# EAGLE design BusCon15 (EAGLE 4.11)
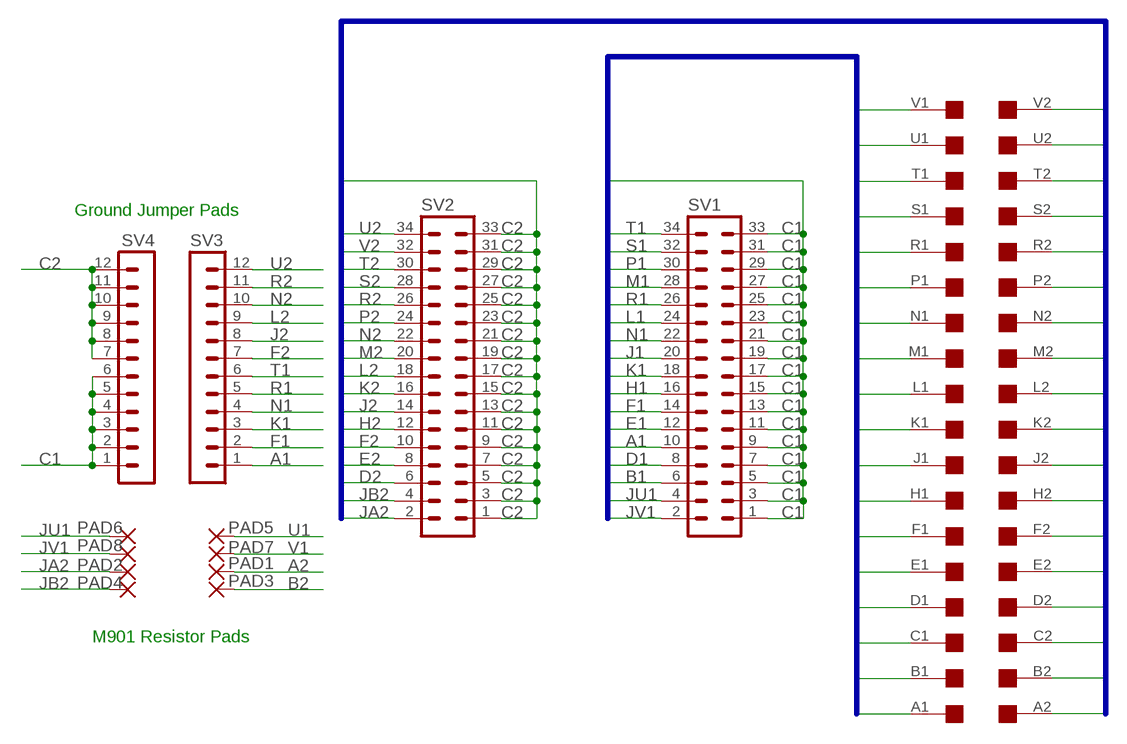
[diagram p0: schematic, sheet 1]

## Parts
PAD1  1,6/0,8  [1,6/0,8]
PAD2  1,6/0,8  [1,6/0,8]
PAD3  1,6/0,8  [1,6/0,8]
PAD4  1,6/0,8  [1,6/0,8]
PAD5  1,6/0,8  [1,6/0,8]
PAD6  1,6/0,8  [1,6/0,8]
PAD7  1,6/0,8  [1,6/0,8]
PAD8  1,6/0,8  [1,6/0,8]
SV1  MA17-2  [MA17-2]
SV2  MA17-2  [MA17-2]
SV3  MA12-1  [MA12-1]
SV4  MA12-1  [MA12-1]
U$4  EDGE-2  [EDGE-CON2]

## Nets
A1: SV1.10 SV3.1 U$4.A1
A2: PAD1.1(P) U$4.A2
B1: SV1.6 U$4.B1
B2: PAD3.1(P) U$4.B2
C1: SV1.1 SV1.3 SV1.5 SV1.7 SV1.9 SV1.11 SV1.13 SV1.15 SV1.17 SV1.19 SV1.21 SV1.23 SV1.25 SV1.27 SV1.29 SV1.31 SV1.33 SV4.1 SV4.2 SV4.3 SV4.4 SV4.5 SV4.6 U$4.C1
C2: SV2.1 SV2.3 SV2.5 SV2.7 SV2.9 SV2.11 SV2.13 SV2.15 SV2.17 SV2.19 SV2.21 SV2.23 SV2.25 SV2.27 SV2.29 SV2.31 SV2.33 SV4.7 SV4.8 SV4.9 SV4.10 SV4.11 SV4.12 U$4.C2
D1: SV1.8 U$4.D1
D2: SV2.6 U$4.D2
E1: SV1.12 U$4.E1
E2: SV2.8 U$4.E2
F1: SV1.14 SV3.2 U$4.F1
F2: SV2.10 SV3.7 U$4.F2
H1: SV1.16 U$4.H1
H2: SV2.12 U$4.H2
J1: SV1.20 U$4.J1
J2: SV2.14 SV3.8 U$4.J2
JA2: PAD2.1(P) SV2.2
JB2: PAD4.1(P) SV2.4
JU1: PAD6.1(P) SV1.4
JV1: PAD8.1(P) SV1.2
K1: SV1.18 SV3.3 U$4.K1
K2: SV2.16 U$4.K2
L1: SV1.24 U$4.L1
L2: SV2.18 SV3.9 U$4.L2
M1: SV1.28 U$4.M1
M2: SV2.20 U$4.M2
N1: SV1.22 SV3.4 U$4.N1
N2: SV2.22 SV3.10 U$4.N2
P1: SV1.30 U$4.P1
P2: SV2.24 U$4.P2
R1: SV1.26 SV3.5 U$4.R1
R2: SV2.26 SV3.11 U$4.R2
S1: SV1.32 U$4.S1
S2: SV2.28 U$4.S2
T1: SV1.34 SV3.6 U$4.T1
T2: SV2.30 U$4.T2
U1: PAD5.1(P) U$4.U1
U2: SV2.34 SV3.12 U$4.U2
V1: PAD7.1(P) U$4.V1
V2: SV2.32 U$4.V2

## Buses
A1,B1,C1,D1,E1,F1,H1,J1,K1,L1,M1,N1,P1,R1,S1,T1,U1,V1
A2,B2,C2,D2,E2,F2,H2,J2,K2,L2,M2,N2,P2,R2,S2,T2,U2,V2

## Notes on the sheet
- Ground Jumper Pads
- M901 Resistor Pads

## Library data of the parts
PAD1-PAD8 = wirepad:1,6/0,8: THROUGH-HOLE PAD
SV1 SV2 = con-lstb:MA17-2: PIN HEADER
SV3 SV4 = con-lstb:MA12-1: PIN HEADER
U$4 = dec-con:EDGE-2: Double-Sided DEC edge connector.

## Board
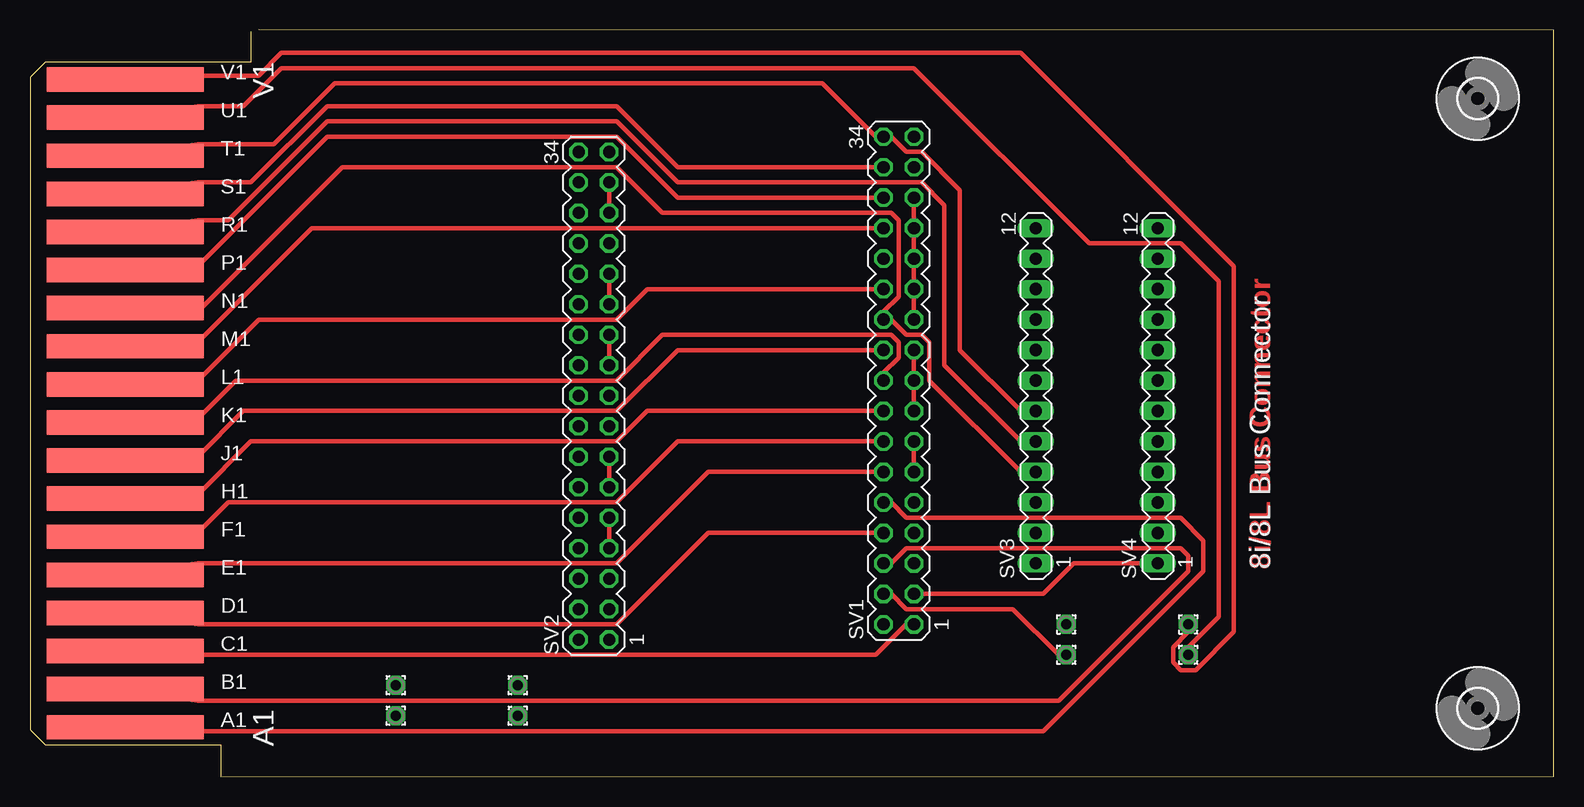
[diagram p1: board, top side]
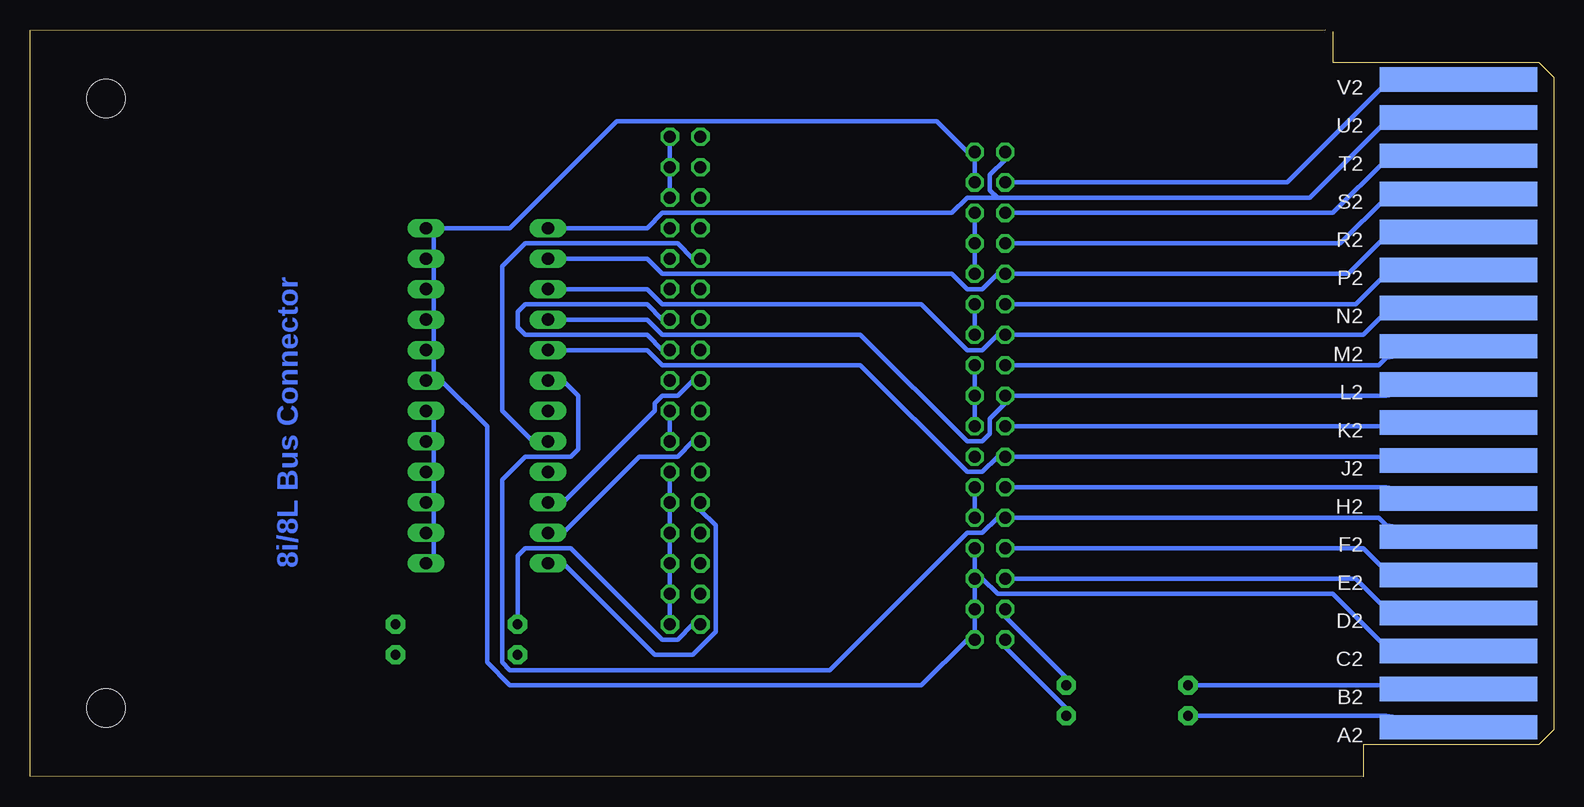
[diagram p2: board, bottom side, seen from below]

Size 126.98 x 62.23 mm. Coordinates in mm from the lower left corner, seen from the top.
Outline: 15.88,0 126.98,0.04 126.98,62.19 19.05,62.23
Copper layers (1*16): Top 0.035mm / dielectric 1.5mm / Bottom 0.035mm
Design rules "olimex10mil": minimum track width 15mil, minimum drill 24mil, track to track 15mil, track to pad 10mil, pad to pad 10mil, via to via 10mil, smd to smd 10mil, copper to edge 25mil, drill to drill 10mil, minimum pad ring 10mil, minimum via ring 8mil, stop-mask expansion 0mil, vias tented up to drill 0mil, thermal gap 10mil

### Footprints (pad centres in the part's own frame; a part is rotated, then mirrored left to right if it is on the bottom)
1,6/0,8 = drill 0.813 pad 1.6 octagon: 1 0,0
MA17-2 = drill 1.016 octagon: 1 -20.32,-1.27; 2 -20.32,1.27; 3 -17.78,-1.27; 4 -17.78,1.27; 5 -15.24,-1.27; 6 -15.24,1.27; 7 -12.7,-1.27; 8 -12.7,1.27; 9 -10.16,-1.27; 10 -10.16,1.27; 11 -7.62,-1.27; 12 -7.62,1.27; 13 -5.08,-1.27; 14 -5.08,1.27; 15 -2.54,-1.27; 16 -2.54,1.27; 17 0,-1.27; 18 0,1.27; 19 2.54,-1.27; 20 2.54,1.27; 21 5.08,-1.27; 22 5.08,1.27; 23 7.62,-1.27; 24 7.62,1.27; 25 10.16,-1.27; 26 10.16,1.27; 27 12.7,-1.27; 28 12.7,1.27; 29 15.24,-1.27; 30 15.24,1.27; 31 17.78,-1.27; 32 17.78,1.27; 33 20.32,-1.27; 34 20.32,1.27
MA12-1 = drill 1.016 long: 1 -13.97,0; 2 -11.43,0; 3 -8.89,0; 4 -6.35,0; 5 -3.81,0; 6 -1.27,0; 7 1.27,0; 8 3.81,0; 9 6.35,0; 10 8.89,0; 11 11.43,0; 12 13.97,0
3,2 = hole 3.2: 0,0
EDGE-CON2 = smd 13.106 x 2.032: A1 7.938,4.128; B1 7.938,7.303; C1 7.938,10.477; D1 7.938,13.652; E1 7.938,16.828; F1 7.938,20.003; H1 7.938,23.177; J1 7.938,26.352; K1 7.938,29.527; L1 7.938,32.703; M1 7.938,35.877; N1 7.938,39.053; P1 7.938,42.227; R1 7.938,45.403; S1 7.938,48.578; T1 7.938,51.752; U1 7.938,54.928; V1 7.938,58.102 | smd 13.106 x 2.032 bottom: A2 7.938,4.128; B2 7.938,7.303; C2 7.938,10.477; D2 7.938,13.652; E2 7.938,16.828; F2 7.938,20.003; H2 7.938,23.177; J2 7.938,26.352; K2 7.938,29.527; L2 7.938,32.703; M2 7.938,35.877; N2 7.938,39.053; P2 7.938,42.227; R2 7.938,45.403; S2 7.938,48.578; T2 7.938,51.752; U2 7.938,54.928; V2 7.938,58.102

### Placement (x,y rotation side)
PAD1  30.48,5.08 0 top
PAD2  40.64,5.08 0 top
PAD3  30.48,7.62 0 top
PAD4  40.64,7.62 0 top
PAD5  96.52,10.16 180 top
PAD6  86.36,10.16 180 top
PAD7  96.52,12.7 180 top
PAD8  86.36,12.7 180 top
SV1  72.39,33.02 90 top
SV2  46.99,31.75 90 top
SV3  83.82,31.75 90 top
SV4  93.98,31.75 90 top
U$2  [3,2]  120.65,5.71 0 top
U$3  [3,2]  120.65,56.52 0 top
U$4  0,0 0 top

### Tracks (layer width: path | path; a pad name or v marks a point on that pad's centre or on a via)
A1
  Top 0.381: SV1.10 71.75,22.86 73.03,21.59 95.89,21.59 97.79,19.68 97.79,17.14 84.45,3.81 13.97,3.81 U$4.A1
  Bottom 0.381: SV1.10 71.12,22.23 69.85,20.95 69.85,12.06 71.75,10.16 74.93,10.16 82.55,17.78 SV3.1
A2
  Bottom 0.381: PAD1.1 29.84,5.08 13.97,5.08 U$4.A2
B1
  Top 0.381: SV1.6 71.75,17.78 73.03,19.05 95.89,19.05 96.52,18.41 96.52,17.14 85.72,6.35 13.97,6.35 U$4.B1
B2
  Bottom 0.381: PAD3.1 29.84,7.62 13.97,7.62 U$4.B2
C1
  Top 0.381: SV1.21 73.66,38.73 73.66,40.01 SV1.23 73.66,41.27 73.66,42.55 SV1.25 73.66,43.81 73.66,45.09 SV1.27 73.66,46.35 73.66,47.62 SV1.29 | SV1.15 73.66,31.11 73.66,32.38 SV1.17 73.66,33.66 73.66,34.92 SV1.19 | SV1.13 73.66,27.3 73.66,26.04 SV1.11 | SV4.1 92.71,17.78 87,17.78 84.45,15.24 74.3,15.24 SV1.3 | U$4.C1 13.97,10.16 70.48,10.16 73.03,12.7 SV1.1
  Bottom 0.381: SV1.29 73.66,48.9 73.66,50.16 SV1.31 73.66,51.44 73.66,52.7 SV1.33 | SV4.1 93.34,18.41 93.34,19.68 SV4.2 93.34,20.95 93.34,22.23 SV4.3 93.34,23.5 93.34,24.77 SV4.4 93.34,26.04 93.34,27.3 SV4.5 93.34,28.57 93.34,29.84 SV4.6 | SV1.13 73.66,28.57 73.66,29.84 SV1.15 | SV1.1 73.66,13.34 73.66,14.61 SV1.3 73.66,15.88 73.66,17.14 SV1.5 73.66,18.41 73.66,19.68 SV1.7 73.66,20.95 73.66,22.23 SV1.9 73.66,23.5 73.66,24.77 SV1.11 | SV1.21 74.3,38.1 75.56,39.37 85.72,39.37 86.36,38.73 86.36,37.47 85.72,36.83 75.56,36.83 74.3,35.56 SV1.19
C2
  Top 0.381: SV2.21 48.26,36.2 48.26,34.92 SV2.19 | SV2.31 48.26,48.9 48.26,47.62 SV2.29 | SV2.23 48.26,40.01 48.26,41.27 SV2.25 | SV2.13 48.26,26.04 48.26,24.77 SV2.11 | SV2.9 48.26,20.95 48.26,19.68 SV2.7
  Bottom 0.381: SV2.21 48.26,37.47 48.26,38.73 SV2.23 | SV2.15 48.26,29.84 48.26,31.11 SV2.17 48.26,32.38 48.26,33.66 SV2.19 | SV2.31 48.26,50.16 48.26,51.44 SV2.33 48.9,52.07 51.44,54.61 78.11,54.61 87,45.72 92.71,45.72 SV4.12 93.34,45.09 93.34,43.81 SV4.11 93.34,42.55 93.34,41.27 SV4.10 93.34,40.01 93.34,38.73 SV4.9 93.34,37.47 93.34,36.2 SV4.8 93.34,34.92 93.34,33.66 SV4.7 92.71,33.02 88.9,29.21 88.9,9.53 87,7.62 52.7,7.62 48.9,11.43 SV2.1 48.26,12.06 48.26,13.34 SV2.3 48.26,14.61 48.26,15.88 SV2.5 | SV2.25 48.26,42.55 48.26,43.81 SV2.27 48.26,45.09 48.26,46.35 SV2.29 | SV2.9 48.26,22.23 48.26,23.5 SV2.11 | SV2.7 48.26,18.41 48.26,17.14 SV2.5 | SV2.5 47.62,16.51 46.35,15.24 18.41,15.24 13.97,10.79 U$4.C2
D1
  Top 0.381: SV1.8 70.48,20.32 56.52,20.32 48.9,12.7 13.97,12.7 U$4.D1
D2
  Bottom 0.381: SV2.6 45.09,16.51 16.51,16.51 13.97,13.97 U$4.D2
E1
  Top 0.381: SV1.12 70.48,25.4 56.52,25.4 48.9,17.78 13.97,17.78 U$4.E1
E2
  Bottom 0.381: SV2.8 45.09,19.05 15.88,19.05 13.97,17.14 U$4.E2
F1
  Top 0.381: SV1.14 70.48,27.94 53.98,27.94 48.9,22.86 16.51,22.86 13.97,20.32 U$4.F1
  Bottom 0.381: SV1.14 71.75,27.94 73.03,26.67 76.2,26.67 82.55,20.32 SV3.2
F2
  Bottom 0.381: U$4.F2 13.97,20.95 14.61,21.59 45.09,21.59 SV2.10 46.35,21.59 47.62,20.32 48.9,20.32 60.33,8.89 87,8.89 87.63,9.53 87.63,24.77 85.72,26.67 81.92,26.67 81.28,27.3 81.28,31.75 82.55,33.02 SV3.7
H1
  Top 0.381: SV1.16 70.48,30.48 51.44,30.48 48.9,27.94 18.41,27.94 13.97,23.5 U$4.H1
H2
  Bottom 0.381: SV2.12 45.09,24.13 13.97,24.13 U$4.H2
J1
  Top 0.381: SV1.20 70.48,35.56 53.98,35.56 48.9,30.48 17.78,30.48 13.97,26.67 U$4.J1
J2
  Bottom 0.381: U$4.J2 13.97,26.67 45.09,26.67 SV2.14 46.35,26.67 47.62,25.4 48.9,25.4 57.78,34.29 74.3,34.29 75.56,35.56 82.55,35.56 SV3.8
JA2
  Bottom 0.381: SV2.2 45.72,10.79 40.64,5.71 PAD2.1
JB2
  Bottom 0.381: SV2.4 45.72,13.34 40.64,8.26 PAD4.1
JU1
  Top 0.381: SV1.4 71.75,15.24 73.03,13.97 81.92,13.97 85.72,10.16 PAD6.1
JV1
  Bottom 0.381: SV1.2 71.75,12.7 73.03,11.43 74.3,11.43 81.92,19.05 85.72,19.05 86.36,18.41 86.36,13.34 PAD8.1
K1
  Top 0.381: SV1.18 71.12,33.66 72.39,34.92 72.39,36.2 71.75,36.83 52.7,36.83 48.9,33.02 17.14,33.02 13.97,29.84 U$4.K1
  Bottom 0.381: SV3.3 82.55,22.86 74.93,30.48 74.93,31.11 74.3,31.75 73.03,31.75 71.75,33.02 SV1.18
K2
  Bottom 0.381: SV2.16 45.09,29.21 13.97,29.21 U$4.K2
L1
  Top 0.381: SV1.24 70.48,40.64 51.44,40.64 48.9,38.1 19.05,38.1 13.97,33.02 U$4.L1
L2
  Bottom 0.381: U$4.L2 13.97,31.75 45.09,31.75 SV2.18 45.72,31.11 46.99,29.84 46.99,28.57 47.62,27.94 48.9,27.94 57.78,36.83 74.3,36.83 75.56,38.1 82.55,38.1 SV3.9
M1
  Top 0.381: SV1.28 70.48,45.72 23.5,45.72 13.97,36.2 U$4.M1
M2
  Bottom 0.381: SV2.20 45.09,34.29 14.61,34.29 13.97,34.92 U$4.M2
N1
  Top 0.381: SV3.4 82.55,25.4 74.93,33.02 74.93,36.2 74.3,36.83 73.03,36.83 71.75,38.1 SV1.22 71.12,38.73 72.39,40.01 72.39,46.35 71.75,46.99 52.7,46.99 48.9,50.8 26.04,50.8 13.97,38.73 U$4.N1
N2
  Bottom 0.381: U$4.N2 13.97,38.73 15.88,36.83 45.09,36.83 SV2.22 46.35,36.83 47.62,35.56 48.9,35.56 52.7,39.37 74.3,39.37 75.56,40.64 82.55,40.64 SV3.10
P1
  Top 0.381: SV1.30 70.48,48.26 53.98,48.26 48.9,53.34 24.77,53.34 13.97,42.55 U$4.P1
P2
  Bottom 0.381: SV2.24 45.09,39.37 16.51,39.37 13.97,41.91 U$4.P2
R1
  Top 0.381: SV3.5 82.55,27.94 76.2,34.29 76.2,47.62 74.3,49.53 53.98,49.53 48.9,54.61 24.77,54.61 16.51,46.35 13.97,46.35 U$4.R1
  Bottom 0.381: SV1.26 71.75,43.18 73.03,44.45 85.72,44.45 87.63,42.55 87.63,30.48 85.09,27.94 SV3.5
R2
  Bottom 0.381: U$4.R2 13.97,45.09 17.14,41.91 45.09,41.91 SV2.26 46.35,41.91 47.62,40.64 48.9,40.64 50.16,41.91 74.3,41.91 75.56,43.18 82.55,43.18 SV3.11
S1
  Top 0.381: SV1.32 70.48,50.8 53.98,50.8 48.9,55.88 24.77,55.88 18.41,49.53 13.97,49.53 U$4.S1
S2
  Bottom 0.381: SV2.28 45.09,44.45 17.78,44.45 13.97,48.26 U$4.S2
T1
  Top 0.381: SV3.6 82.55,30.48 77.47,35.56 77.47,48.9 74.3,52.07 73.03,52.07 71.75,53.34 SV1.34 70.48,53.34 66.04,57.78 25.4,57.78 20.32,52.7 13.97,52.7 U$4.T1
T2
  Bottom 0.381: SV2.30 45.09,46.99 18.41,46.99 13.97,51.44 U$4.T2
U1
  Top 0.381: PAD5.1 96.52,10.79 99.06,13.34 99.06,41.27 95.89,44.45 88.27,44.45 73.66,59.05 20.95,59.05 17.78,55.88 13.97,55.88 U$4.U1
U2
  Bottom 0.381: 46.35,48.26 46.99,48.9 46.99,50.16 45.72,51.44 SV2.34 | 46.35,48.26 20.32,48.26 13.97,54.61 U$4.U2 | 46.35,48.26 48.9,48.26 50.16,46.99 74.3,46.99 75.56,45.72 82.55,45.72 SV3.12
V1
  Top 0.381: PAD7.1 96.52,12.06 95.25,10.79 95.25,9.53 95.89,8.89 97.16,8.89 100.33,12.06 100.33,42.55 82.55,60.33 20.95,60.33 19.05,58.42 13.97,58.42 U$4.V1
V2
  Bottom 0.381: SV2.32 45.09,49.53 22.23,49.53 13.97,57.78 U$4.V2

### Text on the board
Top: 8i/8L Bus Connector
Bottom: 8i/8L Bus Connector
tPlace: 8i/8L Bus Connector
tNames: V1 | A1
tValues: * | * | * | * | * | * | * | * | * | * | * | * | * | * | * | * | Jumper unless M901 | * | * | M90x/W0x1 - always used | M901/M903/M904 - Use both | M901 | 10ohm | M901 | * - Posibus/Negibus Signal | 10ohm